# EAGLE design blink1mk3_micro1a (EAGLE 9.0.0)
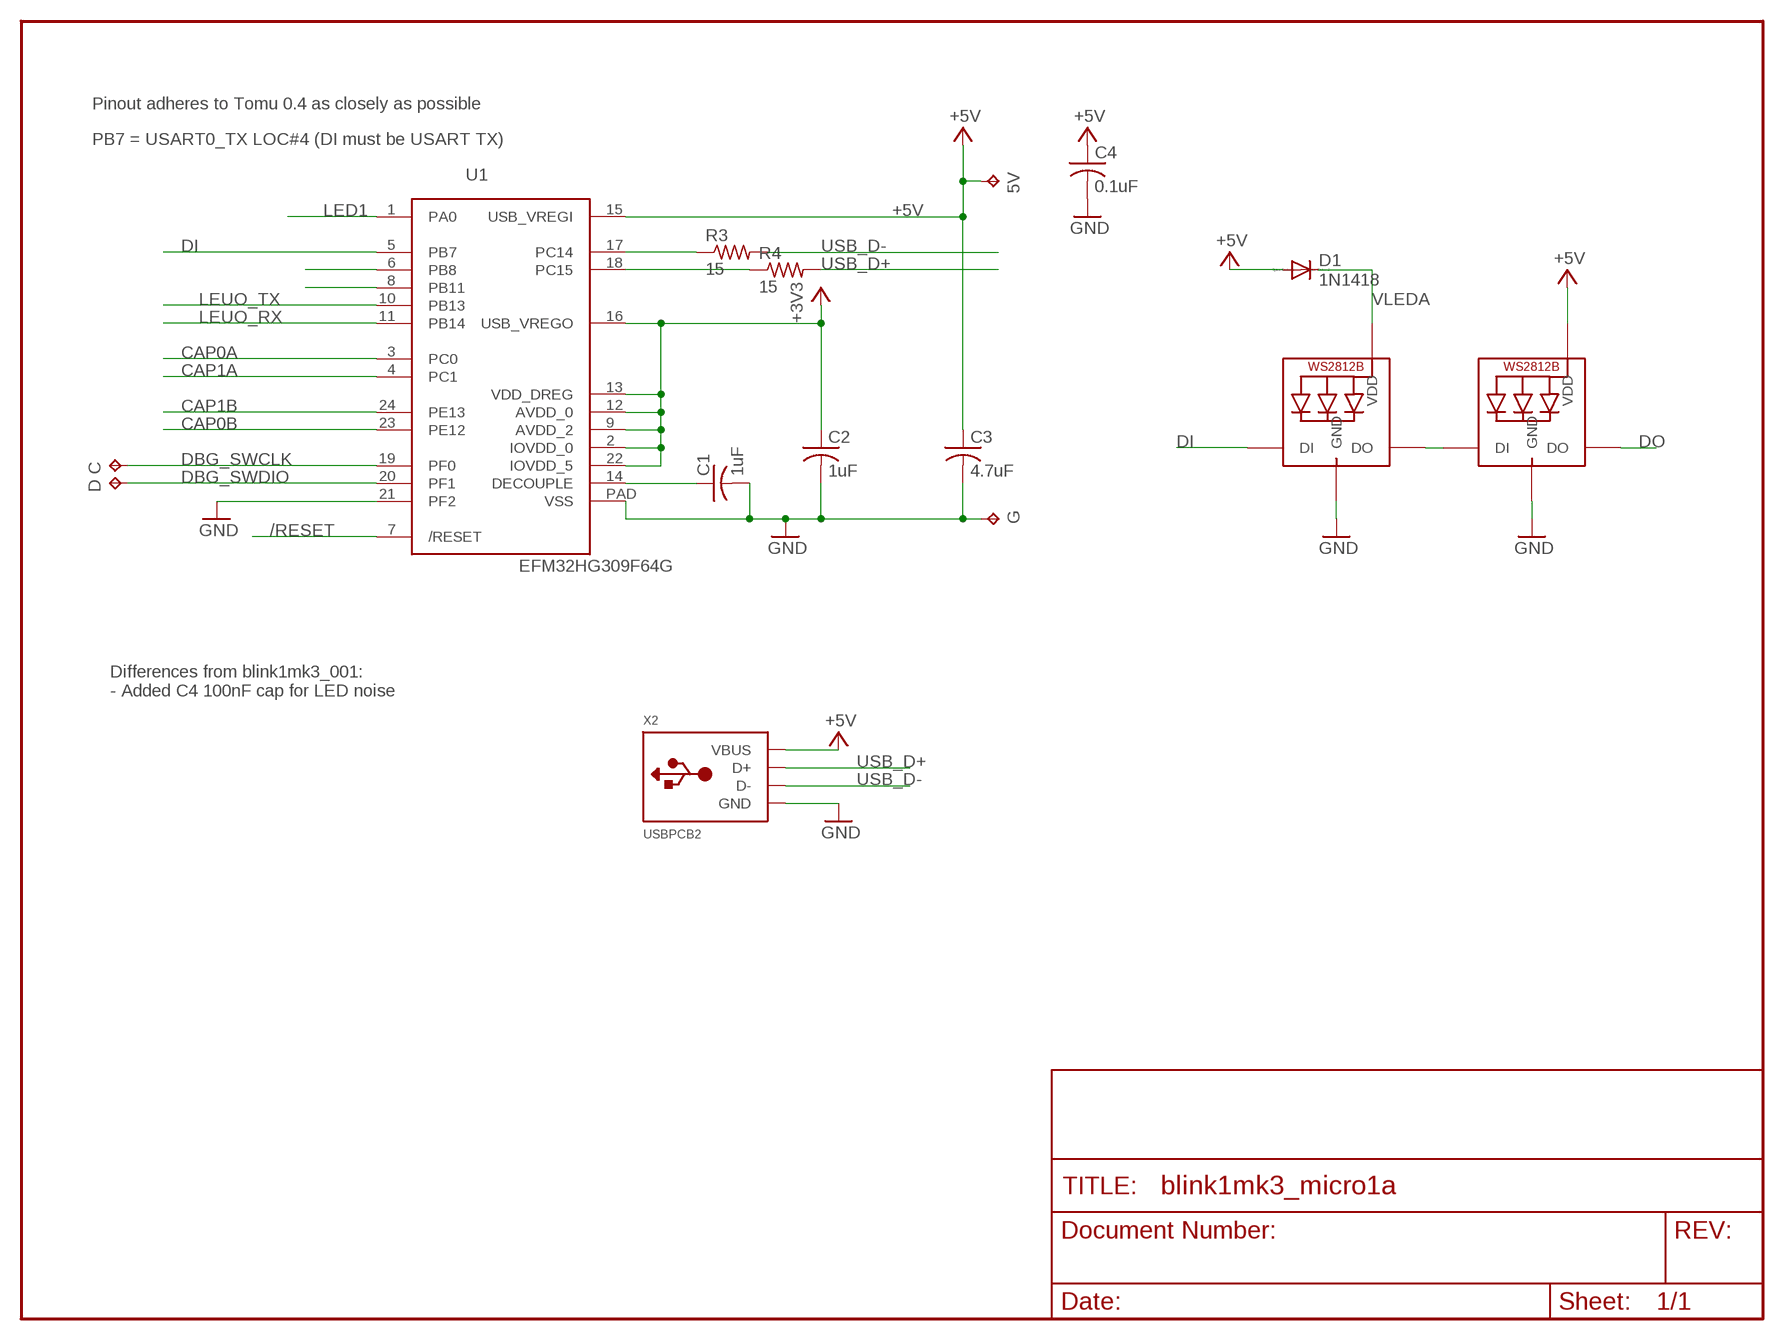
[diagram p0: schematic, sheet 1]

## Parts
5V  TPTP10R  [TP10R]
C  TPTP10R  [TP10R]
C1  1uF  C-USC0402  [C0402]
C2  1uF  C-USC0402  [C0402]
C3  4.7uF  C-USC0402  [C0402]
C4  0.1uF  C-USC0402  [C0402]
D  TPTP10R  [TP10R]
D1  1N1418  DIODE-SOD523  [SOD523]
G  TPTP10R  [TP10R]
LED1  WS2812B4020SIDE  [SK6812-SIDE]
LED2  WS2812B4020SIDE  [SK6812-SIDE]
R3  15  R-US_R0402  [R0402]
R4  15  R-US_R0402  [R0402]
U1  EFM32HG309F64G  [QFN24PAD]
X2  USBPCB2  [USB-A-PCB-2]

## Nets
+3V3: C2.1 U1.2(IOVDD_0) U1.9(AVDD_2) U1.12(AVDD_0) U1.13(VDD_DREG) U1.16(USB_VREGO) U1.22(IOVDD_5)
+5V: 5V.TP C3.1 C4.1 D1.A LED2.1-VDD(VDD) U1.15(USB_VREGI) X2.5V(VBUS)
/RESET: U1.7(/RESET)
CAP0A: U1.3(PC0)
CAP0B: U1.23(PE12)
CAP1A: U1.4(PC1)
CAP1B: U1.24(PE13)
DBG_SWCLK: C.TP U1.19(PF0)
DBG_SWDIO: D.TP U1.20(PF1)
DECOUPLE: C1.1 U1.14(DECOUPLE)
DI: LED1.4-DIN(DI) U1.5(PB7)
DO: LED2.2-DOUT(DO)
GND: C1.2 C2.2 C3.2 C4.2 G.TP LED1.3-GND(GND) LED2.3-GND(GND) U1.21(PF2) U1.PAD(VSS) X2.GND
LED1: U1.1(PA0)
LEUO_RX: U1.11(PB14)
LEUO_TX: U1.10(PB13)
N$1: U1.8(PB11)
N$2: LED1.2-DOUT(DO) LED2.4-DIN(DI)
N$3: U1.6(PB8)
RUSB_D+: R4.1 U1.18(PC15)
RUSB_D-: R3.1 U1.17(PC14)
USB_D+: R4.2 X2.USB_P(D+)
USB_D-: R3.2 X2.USB_M(D-)
VLEDA: D1.C LED1.1-VDD(VDD)

## Notes on the sheet
- Pinout adheres to Tomu 0.4 as closely as possible
- PB7 = USART0_TX LOC#4 (DI must be USART TX)
- Differences from blink1mk3_001:
  - Added C4 100nF cap for LED noise

## Library data of the parts
5V C D G = testpad:TP: Test pad
C1-C4 = adafruit:C-US: CAPACITOR, American symbol
D1 = diode:DIODE-: DIODE
LED1 LED2 = todstuff:WS2812B
R3 R4 = adafruit:R-US_: RESISTOR, American symbol
U1 = todstuff:EFM32HG309F64G
X2 = todstuff:USB

## Board
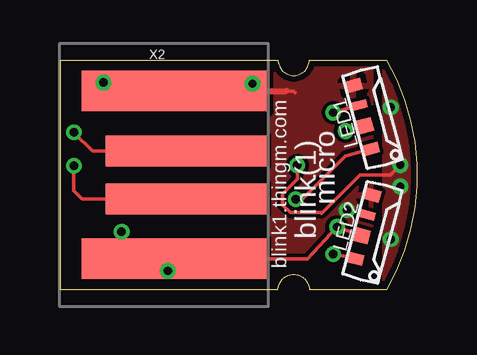
[diagram p1: board, top side]
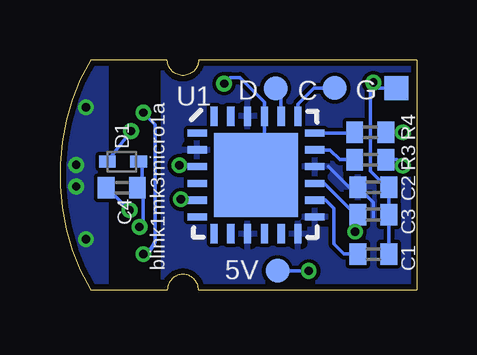
[diagram p2: board, bottom side, seen from below]

Size 14.88 x 9.6 mm. Coordinates in mm from the lower left corner, seen from the top.
Outline: 0,9.6 9.1,9.6 arc180 10.4,9.6 13.61,9.6 arc-60 13.61,0 10.4,0 arc180 9.1,0 0,0 0,9.6
Copper layers (1*16): Top 0.035mm / dielectric 0.73mm / Bottom 0.035mm
Design rules "SeeedStudio_2layer_DRU_no_angle_20140221_blink1thin *": minimum track width 6mil, minimum drill 12mil, track to track 6mil, track to pad 6mil, pad to pad 6mil, via to via 6mil, smd to smd 0mil, copper to edge 10mil, drill to drill 10mil, minimum pad ring 10mil, minimum via ring 6mil, stop-mask expansion 2mil, vias tented up to drill 100mil, thermal gap 10mil

### Footprints (pad centres in the part's own frame; a part is rotated, then mirrored left to right if it is on the bottom)
TP10R = smd 1 x 1: TP 0,0
C0402 = smd 0.7 x 0.9: 1 -0.65,0; 2 0.65,0
SOD523 = smd 0.7 x 0.5: A 0.7,0; C -0.6,0
TP10SQ = smd 1 x 1: TP 0,0
SK6812-SIDE = smd 0.6 x 0.7: 1-VDD 0.25,-0.45 | smd 0.35 x 0.7: 2-DOUT -0.65,-0.45 | smd 0.5 x 0.7: 3-GND -1.5,-0.45 | smd 0.45 x 0.7: 4-DIN 1.25,-0.45
R0402 = smd 0.7 x 0.9: 1 -0.65,0; 2 0.65,0
QFN24PAD = smd 0.8 x 0.3: 1 -2.45,1.75; 2 -2.45,1.05; 3 -2.45,0.35; 4 -2.45,-0.35; 5 -2.45,-1.05; 6 -2.45,-1.75; 13 2.45,-1.75; 14 2.45,-1.05; 15 2.45,-0.35; 16 2.45,0.35; 17 2.45,1.05; 18 2.45,1.75 | smd 0.3 x 0.8: 7 -1.75,-2.45; 8 -1.05,-2.45; 9 -0.35,-2.45; 10 0.35,-2.45; 11 1.05,-2.45; 12 1.75,-2.45; 19 1.75,2.45; 20 1.05,2.45; 21 0.35,2.45; 22 -0.35,2.45; 23 -1.05,2.45; 24 -1.75,2.45 | smd 3.5 x 3.5: PAD 0,0
USB-A-PCB-2 = smd 7.75 x 1.69: 5V -1.47,-3.5; GND -1.47,3.5 | smd 6.75 x 1.3: USB_M -0.97,-1; USB_P -0.97,1

### Placement (x,y rotation side)
5V  5.8,0.8 0 bottom
C  3.41,8.43 0 bottom
C1  1.81,1.5 0 bottom
C2  1.81,4.29 0 bottom
C3  1.81,3.15 0 bottom
C4  12.3,4.27 180 bottom
D  5.89,8.41 0 bottom
D1  12.3,5.35 0 bottom
G  TPTP10SQ  [TP10SQ]  0.86,8.42 0 bottom
LED1  13.06,7.2 285 top
LED2  13.06,2.4 255 top
R3  1.94,5.43 0 bottom
R4  1.94,6.58 0 bottom
U1  6.7,4.8 0 bottom
X2  6.25,4.8 0 top

### Tracks (layer width: path | path; a pad name or v marks a point on that pad's centre or on a via)
+3V3
  Bottom 0.152: 3.68,5.15 2.82,4.29 C2.1 1.81,3.64 1.81,3.02
  pour Bottom: 10.58,10.01 10.58,-0.15 -0.35,-0.03 -0.35,10.13
+5V  (via drill 0.35)
  Top 0.152: v2.57,2.43 2.57,1.24 2.63,1.3 X2.5V | LED2.1-VDD v11.56,2.63 10.33,1.3 X2.5V | X2.5V 5.1,0.98 v4.5,0.8
  Bottom 0.152: 2.57,3.15 C3.1 | C3.1 2.46,2.54 v2.57,2.43 | 11.46,4.02 11.45,4.2 | 11.45,4.2 C4.1 | 11.38,4.1 C4.1 | v11.56,2.63 11.46,2.44 11.4,2.7 11.4,4.22 C4.1 | D1.A 11.45,5.3 11.45,4.4 11.45,4.2 | 5V.TP v4.5,0.8 | U1.15 3.85,4.45 2.55,3.15 C3.1
CAP0A  (via drill 0.35)
  Top 0.152: v9.9,5.2 9.9,4.63 9.28,4.01 9.28,3.55 9.61,3.23 10.87,3.23 10.9,3.2 12.5,4.8 13.78,4.8 v14.2,5.22
  Bottom 0.152: U1.3 9.85,5.15 v9.9,5.2
  other vias: 14.2,4.32 13.8,2.12 13.8,7.62
  pour Bottom: 12.9,9.6 15,9.6 15,0.1 12.9,0.1
  pour Top: 13.5,9.6 15,9.6 15,0 13.5,0
DBG_SWCLK
  Bottom 0.152: C.TP 4.28,8.43 4.95,7.75 U1.19
DBG_SWDIO
  Bottom 0.152: 5.68,8.21 D.TP 5.65,8.18 U1.20
DECOUPLE
  Bottom 0.152: C1.1 3.03,1.5 3.46,1.92 3.46,3.4 3.81,3.75 U1.14
DI  (via drill 0.35)
  Top 0.152: 12.88,5.8 LED1.4-DIN 11.9,5.6 10.08,3.78 v9.84,3.78
  Bottom 0.152: v9.84,3.78 9.8,3.75 U1.5
GND  (via drill 0.35)
  Top 0.152: v1.81,8.66 1.86,8.3 X2.GND 7.62,8.98 v8.03,8.61 | 9.43,8.3 9.74,8.3 9.81,8.23
  Top 0.254: X2.GND 9.43,8.3
  Bottom 0.152: C1.2 C3.2 C2.2 1.27,4.29 1.94,4.96 1.94,8.53 v1.81,8.66 1.57,8.42 G.TP | C4.2 v11.97,3.33 | v8.03,8.61 7.78,8.86 7.37,8.86 6.35,7.85 U1.21 6.35,5.15 U1.PAD
  pour Top: 13.01,9.88 13.01,-0.28 12.08,-0.41 8.79,-0.41 8.79,9.88
N$2  (via drill 0.35)
  Top 0.152: LED2.4-DIN v11.4,1.5 | LED1.2-DOUT v11.4,7.4
  Bottom 0.152: v11.4,7.4 10.9,6.9 10.9,2 11.2,1.5 v11.4,1.5
RUSB_D+
  Bottom 0.152: U1.18 2.61,6.55 R4.1
RUSB_D-
  Bottom 0.152: R3.1 3.21,5.43 3.62,5.85 U1.17
USB_D+  (via drill 0.35)
  Top 0.152: X2.USB_P 1.36,5.8 v0.58,6.58
  Bottom 0.152: R4.2 v0.58,6.58
USB_D-  (via drill 0.35)
  Top 0.152: X2.USB_M 0.94,3.8 0.58,4.15 v0.58,5.18
  Bottom 0.152: R3.2 0.83,5.43 v0.58,5.18
VLEDA  (via drill 0.35)
  Top 0.152: v11.91,6.63 11.93,6.65 LED1.1-VDD
  Bottom 0.152: D1.C v11.91,6.63

### Text on the board
tPlace: micro | blink(1) | blink1.thingm.com
bPlace: blink1mk3micro1a